# Altium project Iot-Switch.PrjPcb
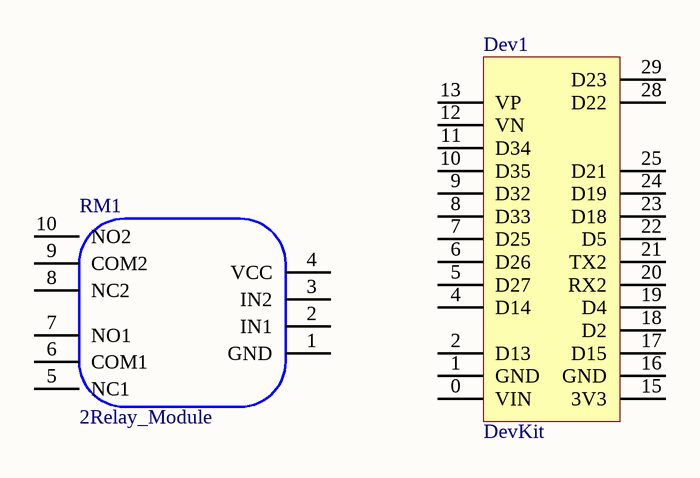
[diagram p0: IoT-Switch.SchDoc]
1 sheet, 2 parts. Net scope: global (net labels, ports and power ports of the same name join across sheets).
Board file: IoT-Switch.PcbDoc

## Sheet IoT-Switch.SchDoc
size A4

### Parts
Dev1  DevKit  [DevKit]
RM1  2Relay_Module

### Nets

Not connected (* = marked no-connect by the designer): Dev1 0(VIN) 1(GND) 2(D13) 3(D12) 4(D14) 5(D27) 6(D26) 7(D25) 8(D33) 9(D32) 10(D35) 11(D34) 12(VN) 13(VP) 14(EN) 15(3V3) 16(GND) 17(D15) 18(D2) 19(D4) 20(RX2) 21(TX2) 22(D5) 23(D18) 24(D19) 25(D21) 26(RX0) 27(TX0) 28(D22) 29(D23); RM1 1(GND) 2(IN1) 3(IN2) 4(VCC) 5(NC1) 6(COM1) 7(NO1) 8(NC2) 9(COM2) 10(NO2)

### Library data of the parts
Dev1 = DevKit_V1